# EAGLE design wifibasestation (EAGLE 6.5.0)
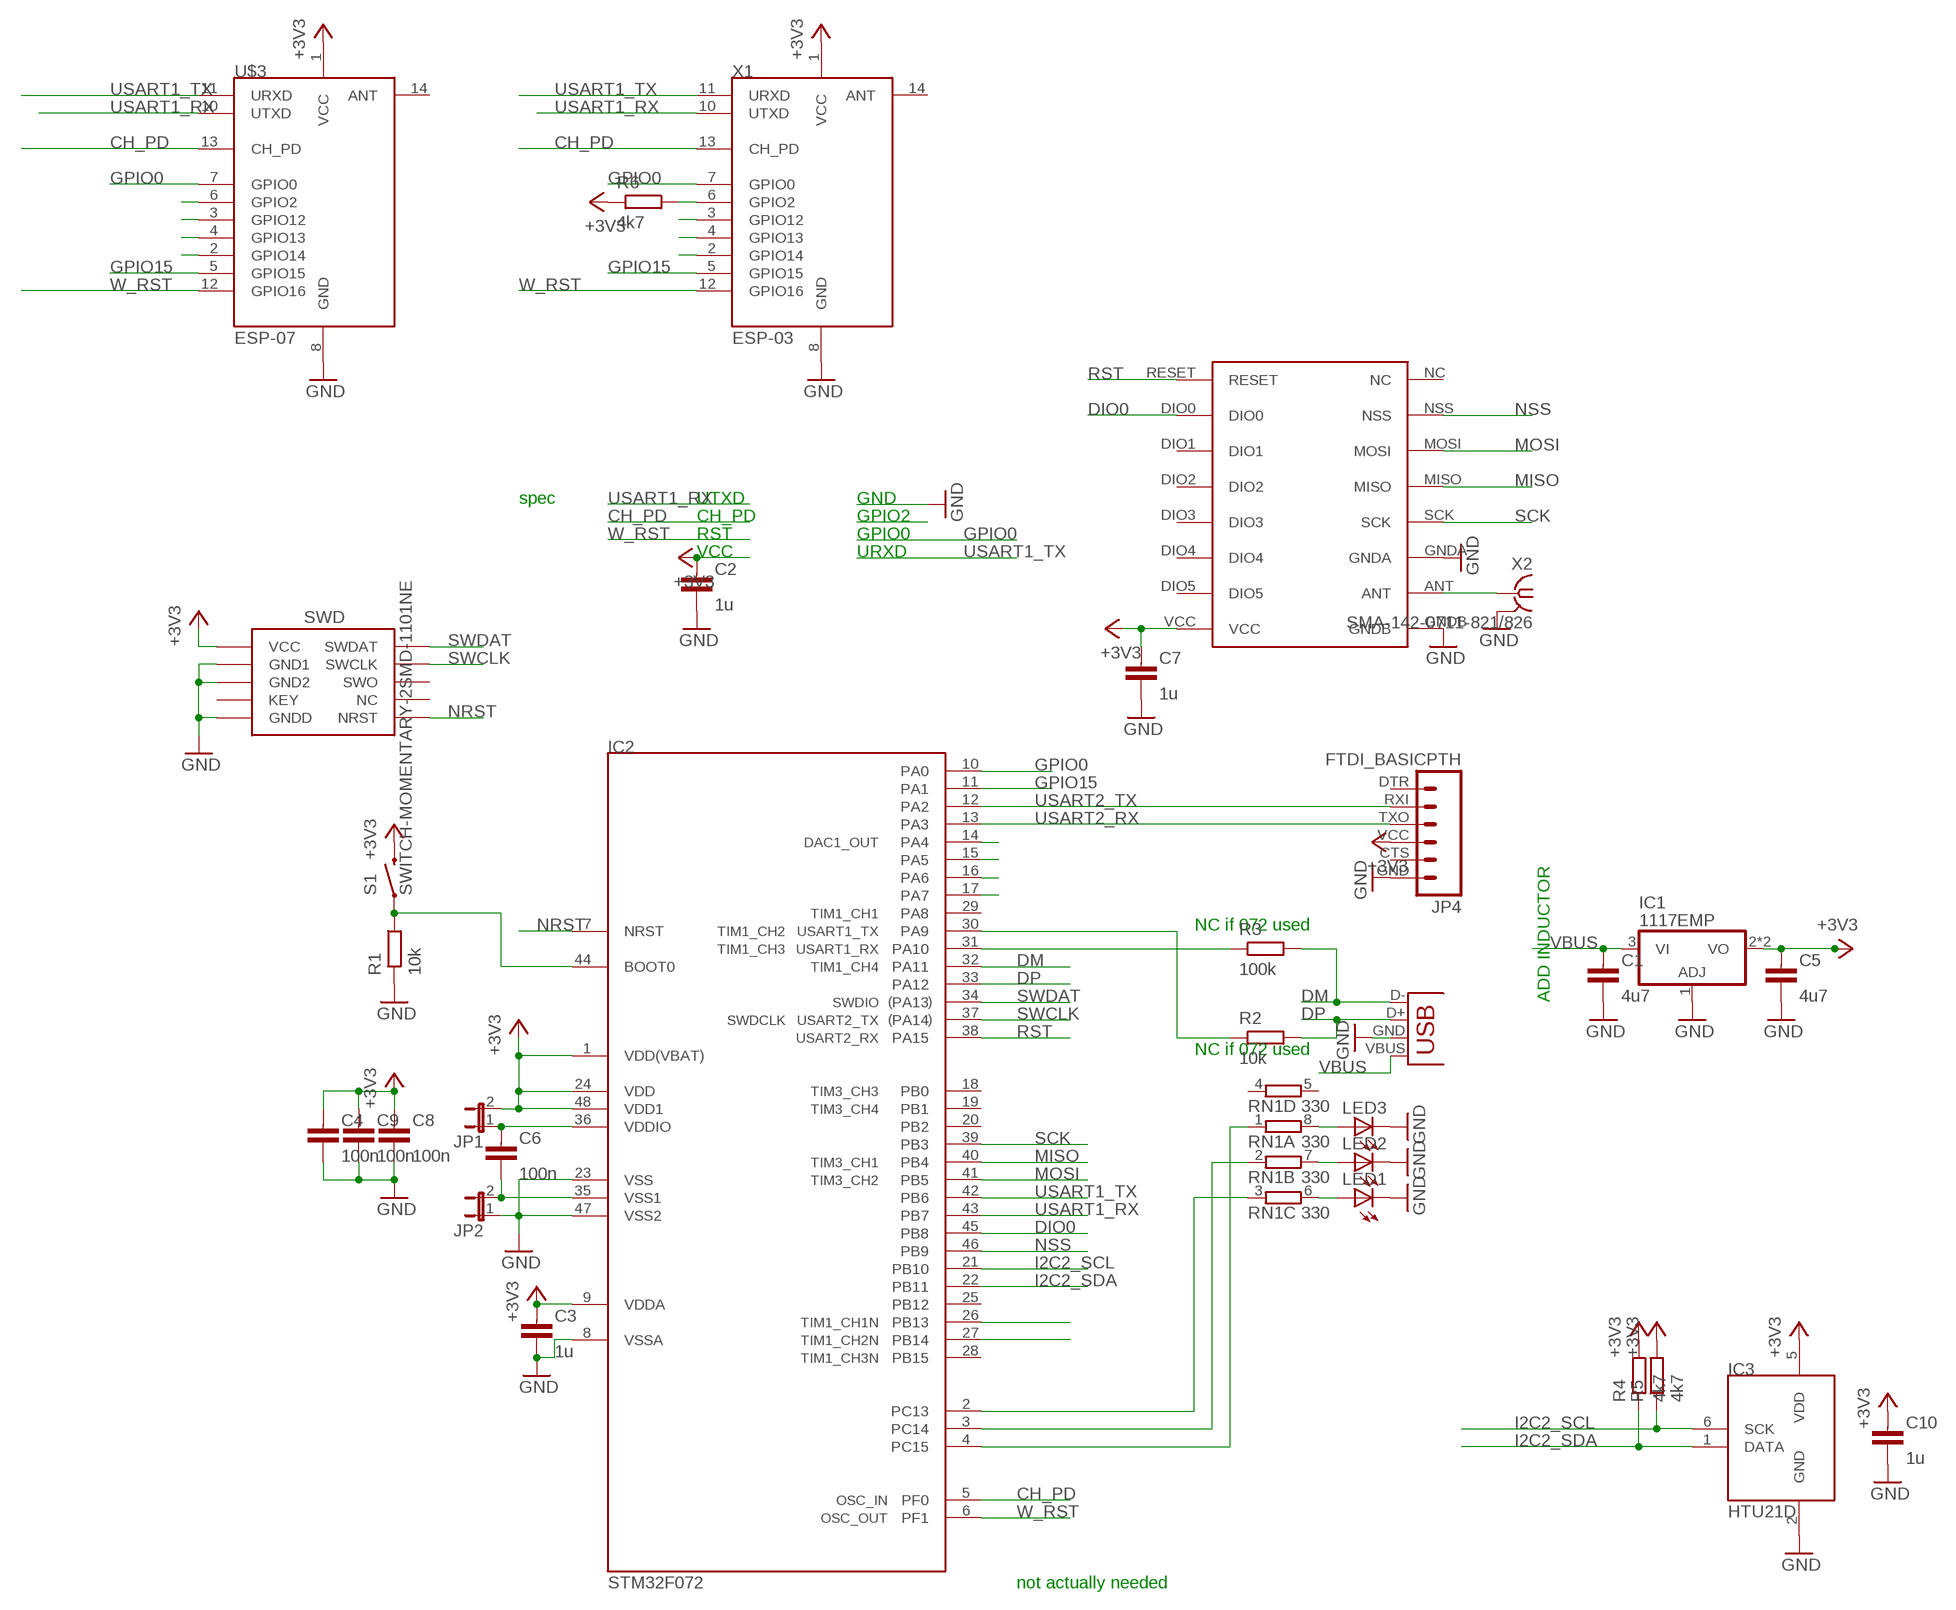
[diagram p0: schematic, sheet 1]

## Parts
C1  4u7  CAPACITOR0603-N  [C0603-N]
C2  1u  CAPACITOR0603-N  [C0603-N]
C3  1u  CAPACITOR0603-N  [C0603-N]
C4  100n  CAPACITOR0603-N  [C0603-N]
C5  4u7  CAPACITOR0805-N  [C0805-N]
C6  100n  CAPACITOR0603-N  [C0603-N]
C7  1u  CAPACITOR0603-N  [C0603-N]
C8  100n  CAPACITOR0603-N  [C0603-N]
C9  100n  CAPACITOR0603-N  [C0603-N]
C10  1u  CAPACITOR0603-N  [C0603-N]
IC1  1117EMP  [SOT223]
IC2  STM32F072  [TQFP48]
IC3  HTU21D  [DFN6-L]
J1  SWD_SHROUD_SMD  [SWD_SMD_SHROUD]
JP1  JUMPER-2SMD-NC  [SJ_2S]
JP2  JUMPER-2SMD-NC  [SJ_2S]
JP3  USB-A-H  [USB-A-H]
JP4  FTDI_BASICPTH  [FTDI_BASIC]
LED1  LEDCHIP-LED0805  [CHIP-LED0805]
LED2  LEDCHIP-LED0805  [CHIP-LED0805]
LED3  LEDCHIP-LED0805  [CHIP-LED0805]
R1  10k  RESISTOR0603-N  [R0603-N]
R2  10k  RESISTOR0603-N  [R0603-N]
R3  100k  RESISTOR0603-N  [R0603-N]
R4  4k7  RESISTOR0603-N  [R0603-N]
R5  4k7  RESISTOR0603-N  [R0603-N]
R6  4k7  RESISTOR0603-N  [R0603-N]
RN1  330  4R-NEXB38V  [EXB38V]
S1  SWITCH-MOMENTARY-2SMD-1101NE  [TACTILE-SWITCH-1101NE]
U$2  RFM69HW  [RFM]
U$3  ESP-07  [ESP-07]
X1  ESP-03  [ESP-03]
X2  SMA-142-0711-821/826  [J502-ND-142-0711-821/826]

## Nets
+3V3: C2.1 C3.1 C4.1 C5.1 C7.1 C8.1 C9.1 C10.1 IC1.2(VO) IC1.4(VO) IC2.1(VDD(VBAT)) IC2.9(VDDA) IC2.24(VDD) IC2.48(VDD1) IC3.5(VDD) J1.1(VCC) JP1.2 JP4.VCC R4.2 R5.2 R6.1 S1.2 U$2.VCC U$3.1(VCC) X1.1(VCC)
CH_PD: IC2.5(PF0) U$3.13(CH_PD) X1.13(CH_PD)
DIO0: IC2.45(PB8) U$2.DIO0
DM: IC2.32(PA11) JP3.D-(D+) R3.2
DP: IC2.33(PA12) JP3.D+(D-) R2.2
GND: C1.2 C2.2 C3.2 C4.2 C5.2 C7.2 C8.2 C9.2 C10.2 IC1.1(ADJ) IC2.8(VSSA) IC2.23(VSS) IC2.47(VSS2) IC3.2(GND) J1.3(GND1) J1.5(GND2) J1.9(GNDD) JP2.1 JP3.GND(VBUS) JP4.GND LED1.C LED2.C LED3.C R1.1 U$2.GNDA U$2.GNDB U$3.8(GND) X1.8(GND) X2.G@1 X2.G@2 X2.G@3 X2.G@4
GPIO0: IC2.10(PA0) U$3.7(GPIO0) X1.7(GPIO0)
GPIO15: IC2.11(PA1) U$3.5(GPIO15) X1.5(GPIO15)
I2C2_SCL: IC2.21(PB10) IC3.6(SCK) R5.1
I2C2_SDA: IC2.22(PB11) IC3.1(DATA) R4.1
MISO: IC2.40(PB4) U$2.MISO
MOSI: IC2.41(PB5) U$2.MOSI
N$1: R6.2 U$3.6(GPIO2) X1.6(GPIO2)
N$2: IC2.2(PC13) RN1.3
N$3: U$3.2(GPIO14) X1.2(GPIO14)
N$4: U$3.4(GPIO13) X1.4(GPIO13)
N$6: U$2.ANT X2.1
N$7: U$3.3(GPIO12) X1.3(GPIO12)
N$8: IC2.14(PA4)
N$9: LED3.A RN1.8
N$10: LED2.A RN1.7
N$11: C6.1 IC2.36(VDDIO) JP1.1
N$12: IC2.15(PA5)
N$13: C6.2 IC2.35(VSS1) JP2.2
N$14: IC2.16(PA6)
N$15: IC2.44(BOOT0) R1.2 S1.1
N$16: IC2.17(PA7)
N$17: IC2.31(PA10) R3.1
N$18: IC2.30(PA9) R2.1
N$20: LED1.A RN1.6
N$21: IC2.3(PC14) RN1.2
N$22: IC2.4(PC15) RN1.1
N$26: IC2.26(PB13)
N$27: IC2.27(PB14)
NRST: IC2.7(NRST) J1.10(NRST)
NSS: IC2.46(PB9) U$2.NSS
RST: IC2.38(PA15) U$2.RESET
SCK: IC2.39(PB3) U$2.SCK
SWCLK: IC2.37(PA14) J1.4(SWCLK)
SWDAT: IC2.34(PA13) J1.2(SWDAT)
USART1_RX: IC2.43(PB7) U$3.10(UTXD) X1.10(UTXD)
USART1_TX: IC2.42(PB6) U$3.11(URXD) X1.11(URXD)
USART2_RX: IC2.13(PA3) JP4.TXO
USART2_TX: IC2.12(PA2) JP4.RXI
VBUS: C1.1 IC1.3(VI) JP3.VBUS(GND)
W_RST: IC2.6(PF1) U$3.12(GPIO16) X1.12(GPIO16)
Unconnected: IC2.18(PB0) IC2.19(PB1) IC2.20(PB2) IC2.25(PB12) IC2.28(PB15) IC2.29(PA8) J1.6(SWO) J1.7(KEY) J1.8(NC) JP4.CTS JP4.DTR RN1.4 RN1.5 U$2.DIO1 U$2.DIO2 U$2.DIO3 U$2.DIO4 U$2.DIO5 U$2.NC U$3.14(ANT) X1.14(ANT)

## Notes on the sheet
- spec | UTXD | GND
- CH_PD | GPIO2
- RST | GPIO0
- VCC | URXD
- NC if 072 used
- ADD INDUCTOR
- NC if 072 used
- not actually needed

## Library data of the parts
C1-C10 = passives-7351:CAPACITOR
IC1 = dtb:*1117: Positive VOLTAGE REGULATOR
IC2 = dtb:STM32F072
IC3 = Mine:HTU21D
J1 = dtb:SWD_SHROUD
JP1 JP2 = SparkFun-Passives:JUMPER-2: Jumper Basic 0.1" spaced jumper. Use with breakaway headers.
JP3 = SparkFun-Connectors:USB: USB Connectors USB-B-PTH is fully proven SKU : PRT-00139/CONN-08278 USB-miniB is fully proven SKU : PRT-00587 USB-A-PCB is untested. USB-A-H is throughly reviewed, but untested. Spark Fun Electronics SKU : PRT-00437 USB-B-SMT is throughly reviewed, but untested. Needs silkscreen touching up. USB-A-S has not been used/tested USB-MB-H has not been used/tested USB-MICROB has been used. CONN-09505
JP4 = SparkFun-Connectors:FTDI_BASIC: FTDI Basic header with labels
LED1-LED3 = led:LED: LED OSRAM: - CHIPLED LG R971, LG N971, LY N971, LG Q971, LY Q971, LO R971, LY R971 LH N974, LH R974 LS Q976, LO Q976, LY Q976 LO Q996 - Hyper CHIPLED LW Q18S LB Q993, LB Q99A, LB R99A - SideLED LS A670, LO A670, LY A670, LG A670, LP A670 LB A673, LV A673, LT A673, LW A673 LH A674 LY A675 LS A676, LA A676, LO A676, LY A676, LW A676 LS A679, LY A679, LG A679 - Hyper Micro SIDELED® LS Y876, LA Y876, LO Y876, LY Y876 LT Y87S - SmartLED LW L88C, LW L88S LB L89C, LB L89S, LG L890 LS L89K, LO L89K, LY L89K LS L896, LA L896, LO L896, LY L896 - TOPLED LS T670, LO T670, LY T670, LG T670, LP T670 LSG T670, LSP T670, LSY T670, LOP T670, LYG T670 LG T671, LOG T671, LSG T671 LB T673, LV T673, LT T673, LW T673 LH T674 LS T676, LA T676, LO T676, LY T676, LB T676, LH T676, LSB T676, LW T676 LB T67C, LV T67C, LT T67C, LS T67K, LO T67K, LY T67K, LW E67C LS E67B, LA E67B, LO E67B, LY E67B, LB E67C, LV E67C, LT E67C LW T67C LS T679, LY T679, LG T679 LS T770, LO T770, LY T770, LG T770, LP T770 LB T773, LV T773, LT T773, LW T773 LH T774 LS E675, LA E675, LY E675, LS T675 LS T776, LA T776, LO T776, LY T776, LB T776 LHGB T686 LT T68C, LB T68C - Hyper Mini TOPLED® LB M676 - Mini TOPLED Santana® LG M470 LS M47K, LO M47K, LY M47K Source: http://www.osram.convergy.de LUXEON: - LUMILED® LXK2-PW12-R00, LXK2-PW12-S00, LXK2-PW14-U00, LXK2-PW14-V00 LXK2-PM12-R00, LXK2-PM12-S00, LXK2-PM14-U00 LXK2-PE12-Q00, LXK2-PE12-R00, LXK2-PE12-S00, LXK2-PE14-T00, LXK2-PE14-U00 LXK2-PB12-K00, LXK2-PB12-L00, LXK2-PB12-M00, LXK2-PB14-N00, LXK2-PB14-P00, LXK2-PB14-Q00 LXK2-PR12-L00, LXK2-PR12-M00, LXK2-PR14-Q00, LXK2-PR14-R00 LXK2-PD12-Q00, LXK2-PD12-R00, LXK2-PD12-S00 LXK2-PH12-R00, LXK2-PH12-S00 LXK2-PL12-P00, LXK2-PL12-Q00, LXK2-PL12-R00 Source: www.luxeon.com KINGBRIGHT: KA-3528ASYC Source: www.kingbright.com
R1-R6 = passives-7351:RESISTOR
RN1 = resistor-dil:4R-N: Array Chip Resistor Source: RS Component / Phycomp; OC_FARNELL: unknown; OC_NEWARK: unknown
S1 = SparkFun-Electromechanical:SWITCH-MOMENTARY-2: Various NO switches- pushbuttons, reed, etc; PROD_ID: SWCH-00815
U$2 = hoperf:RFM69HW
U$3 = Mine:ESP-07
X1 = Mine:ESP-03
X2 = con-coax:SMA-: SMA 50 Ohm End Launch Jack Receptacle - Round Contact Johnson Components Source: www.johnsoncomponents.com .. J502-ND.pdf; MF: JOHNSON COMPONENTS; MPN: 142-0711-821; OC_FARNELL: 1019328; OC_NEWARK: 16F3627

## Board
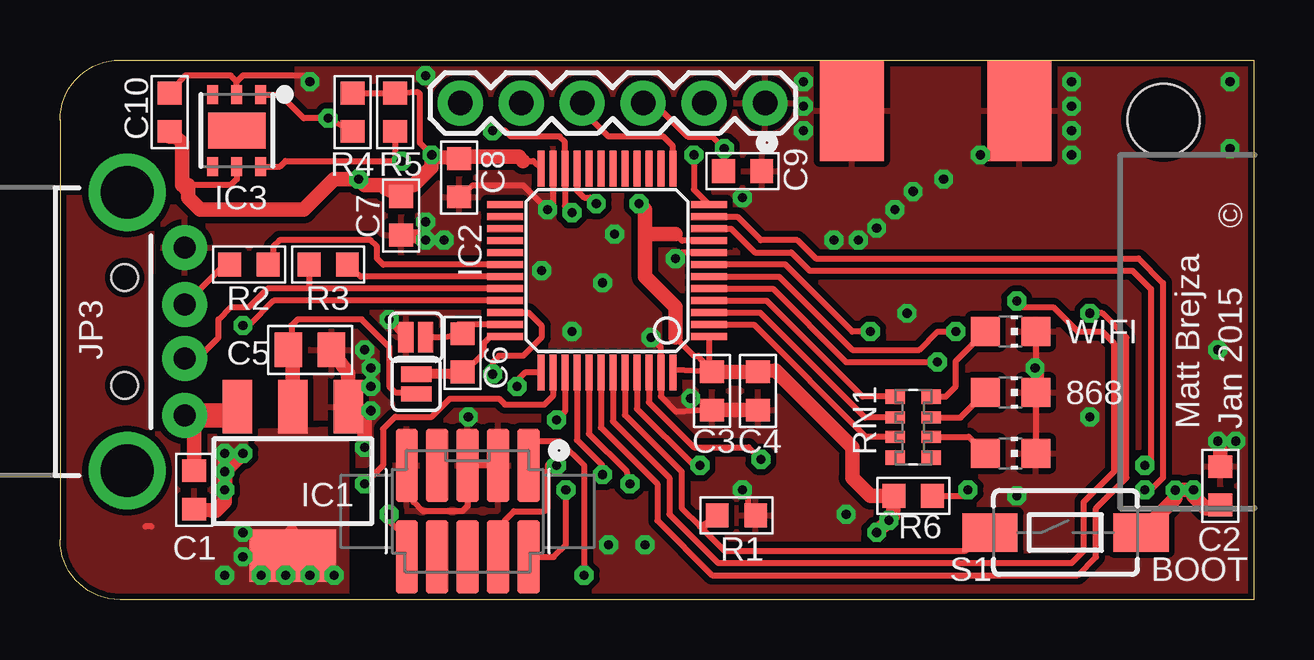
[diagram p1: board, top side]
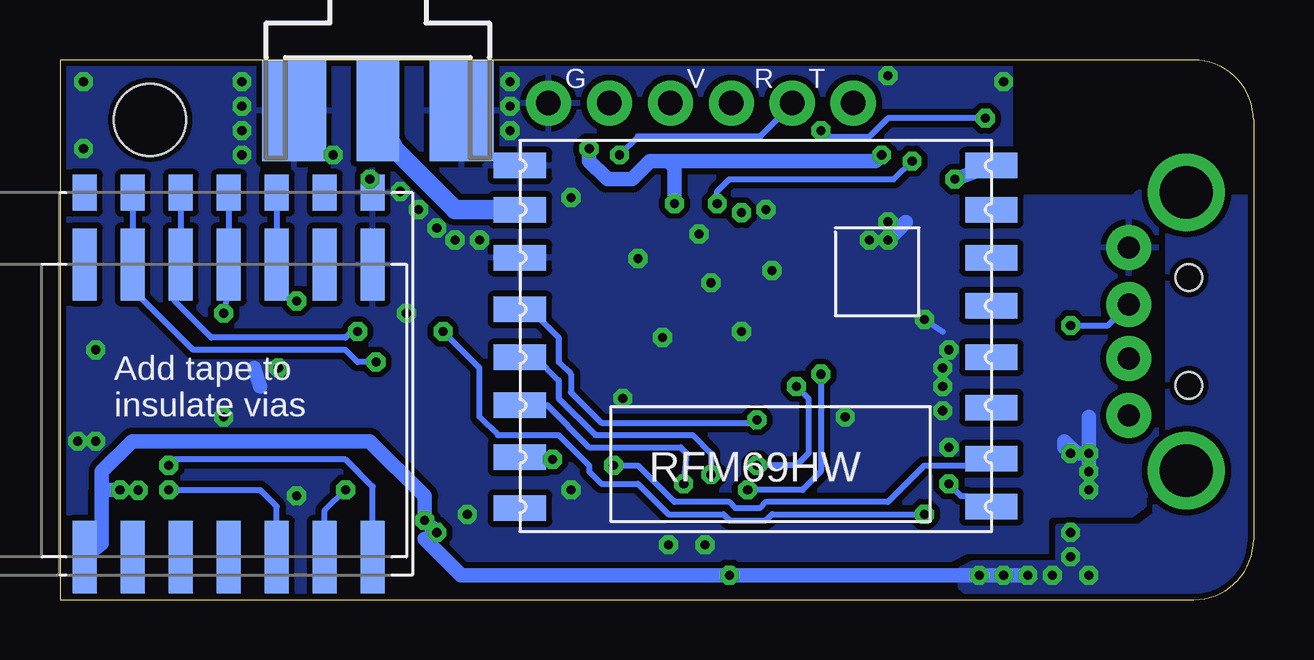
[diagram p2: board, bottom side, seen from below]

Size 49.75 x 22.5 mm. Coordinates in mm from the lower left corner, seen from the top.
Outline: 0,20.01 0,20
Outline: 0,20 0,2.5 arc90 2.5,0 49.75,0 49.75,22.5 2.5,22.5 arc90 0,20
Copper layers (1*16): Top 0.035mm / dielectric 1.5mm / Bottom 0.035mm
Design rules "default *": minimum track width 10mil, minimum drill 15mil, track to track 8mil, track to pad 8mil, pad to pad 7mil, via to via 8mil, smd to smd 0mil, copper to edge 10mil, drill to drill 8mil, minimum pad ring 10mil, minimum via ring 8mil, stop-mask expansion 4mil, vias tented up to drill 16mil, thermal gap 10mil
Holes 3 mm at 45.99,20.01

### Footprints (pad centres in the part's own frame; a part is rotated, then mirrored left to right if it is on the bottom)
C0603-N = smd 0.95 x 1: 1 -0.8,0; 2 0.8,0
C0805-N = smd 1.15 x 1.45: 1 -0.9,0; 2 0.9,0
SOT223 = smd 1.219 x 2.235: 1 -2.311,-3.099; 2 0,-3.099; 3 2.311,-3.099 | smd 3.6 x 2.2: 4 0,3.099
TQFP48 = smd 0.3 x 1.5: 1 -2.75,-4.25; 2 -2.25,-4.25; 3 -1.75,-4.25; 4 -1.25,-4.25; 5 -0.75,-4.25; 6 -0.25,-4.25; 7 0.25,-4.25; 8 0.75,-4.25; 9 1.25,-4.25; 10 1.75,-4.25; 11 2.25,-4.25; 12 2.75,-4.25; 25 2.75,4.25; 26 2.25,4.25; 27 1.75,4.25; 28 1.25,4.25; 29 0.75,4.25; 30 0.25,4.25; 31 -0.25,4.25; 32 -0.75,4.25; 33 -1.25,4.25; 34 -1.75,4.25; 35 -2.25,4.25; 36 -2.75,4.25 | smd 1.5 x 0.3: 13 4.25,-2.75; 14 4.25,-2.25; 15 4.25,-1.75; 16 4.25,-1.25; 17 4.25,-0.75; 18 4.25,-0.25; 19 4.25,0.25; 20 4.25,0.75; 21 4.25,1.25; 22 4.25,1.75; 23 4.25,2.25; 24 4.25,2.75; 37 -4.25,2.75; 38 -4.25,2.25; 39 -4.25,1.75; 40 -4.25,1.25; 41 -4.25,0.75; 42 -4.25,0.25; 43 -4.25,-0.25; 44 -4.25,-0.75; 45 -4.25,-1.25; 46 -4.25,-1.75; 47 -4.25,-2.25; 48 -4.25,-2.75
DFN6-L = smd 0.45 x 0.8: 1 -1,-1.5; 2 0,-1.5; 3 1,-1.5; 4 1,1.5; 5 0,1.5; 6 -1,1.5 | smd 2.4 x 1.5: EP 0,0
SWD_SMD_SHROUD = smd 0.914 x 3.048: 1 -2.54,-1.905; 2 -2.54,1.905; 3 -1.27,-1.905; 4 -1.27,1.905; 5 0,-1.905; 6 0,1.905; 7 1.27,-1.905; 8 1.27,1.905; 9 2.54,-1.905; 10 2.54,1.905
SJ_2S = smd 0.635 x 1.27: 1 -0.412,0; 2 0.412,0
USB-A-H = drill 0.914 pad 1.88: D+ 2.4,1.127; D- 2.4,-1.127; GND 2.4,3.5; VBUS 2.4,-3.5 | drill 2.2: GND2 0,-5.8; GND3 0,5.8 | hole 1.1: -0.1,2.25; -0.1,-2.25
FTDI_BASIC = drill 1.016 pad 1.88: CTS 10.16,0; DTR 0,0; GND 12.7,0; RXI 2.54,0; TXO 5.08,0; VCC 7.62,0
CHIP-LED0805 = smd 1.2 x 1.2: A 0,-1.05; C 0,1.05
R0603-N = smd 0.95 x 1: 1 -0.8,0; 2 0.8,0
EXB38V = smd 0.6 x 0.8: 1 -1.275,-0.75; 4 1.275,-0.75; 5 1.275,0.75; 8 -1.275,0.75 | smd 0.5 x 0.8: 2 -0.4,-0.75; 3 0.4,-0.75; 6 0.4,0.75; 7 -0.4,0.75
TACTILE-SWITCH-1101NE = smd 2.3 x 1.6: 1 -3.15,0; 2 3.15,0
RFM = smd 2.184 x 1.067: ANT 19.651,2.889; DIO0 0,13.27; DIO1 0,11.143; DIO2 0,9.047; DIO3 0,6.889; DIO4 0,4.889; DIO5 0,2.889; GNDA 19.651,4.889; GNDB 19.651,1.048; MISO 19.651,9.047; MOSI 19.651,11.047; NC 19.651,15.334; NSS 19.651,13.206; RESET 0,15.27; SCK 19.651,7.048; VCC 0,1.048
ESP-07 = smd 1 x 1.5: 1 -13.4,0; 2 -11.4,0; 3 -9.4,0; 4 -7.4,0; 5 -5.4,0; 6 -3.4,0; 7 -1.4,0; 8 -1.4,15.95; 9 -3.4,15.95; 10 -5.4,15.95; 11 -7.4,15.95; 12 -9.4,15.95; 13 -11.4,15.95; 14 -13.4,15.95
ESP-03 = smd 1 x 3: 1 -13.4,0; 2 -11.4,0; 3 -9.4,0; 4 -7.4,0; 5 -5.4,0; 6 -3.4,0; 7 -1.4,0; 8 -1.4,12.2; 9 -3.4,12.2; 10 -5.4,12.2; 11 -7.4,12.2; 12 -9.4,12.2; 13 -11.4,12.2; 14 -13.4,12.2
J502-ND-142-0711-821/826 = smd 4.191 x 1.778: 1 2.115,0 | smd 4.191 x 2.667: G@1 2.115,3.495; G@2 2.115,-3.495 | smd 4.191 x 2.667 bottom: G@3 2.115,3.495; G@4 2.115,-3.495

### Placement (x,y rotation side)
C1  5.59,4.58 270 top
C2  48.37,4.75 90 top
C3  27.18,8.7 270 top
C4  29.09,8.7 270 top
C5  10.42,10.42 0 top
C6  16.78,10.29 90 top
C7  14.23,16.01 270 top
C8  16.64,17.59 270 top
C9  28.45,17.86 0 top
C10  4.58,20.32 90 top
IC1  9.71,4.94 180 top
IC2  22.8,13.72 90 top
IC3  7.37,19.56 180 top
J1  16.99,3.69 180 top
JP1  14.85,8.99 270 top
JP2  14.83,10.94 0 top
JP3  2.8,11.18 0 top
JP4  16.69,20.7 0 top
LED1  39.63,6.1 270 top
LED2  39.63,8.64 270 top
LED3  39.63,11.18 270 top
R1  28.2,3.51 180 top
R2  7.88,13.97 180 top
R3  11.18,13.97 180 top
R4  12.2,20.32 90 top
R5  13.97,20.32 90 top
R6  35.56,4.32 0 top
RN1  35.56,7.2 270 top
S1  41.91,2.8 0 top
U$2  10.93,19.15 180 bottom
U$3  35.31,1.02 0 bottom
X1  35.31,1.78 0 bottom
X2  36.5,22.5 270 bottom

### Tracks (layer width: path | path; a pad name or v marks a point on that pad's centre or on a via)
+3V3  (via drill 0.38)
  Top 0.254: C3.1 25.66,9.58 IC2.48 | C3.1 26.6,10.16 26.42,10.16 25.66,10.93 | IC2.1 27.05,9.71 C3.1 | 3.81,3.05 3.56,3.05 | IC3.5 7.37,17.53 7.12,17.28 5.34,17.28 | C10.1 4.58,19.31 | R4.2 R5.2 14.9,21.17 14.99,21.09 14.99,19.05 v15.5,18.55 | C5.1 9.66,10.28 9.66,11.43 9.91,11.69 12.58,11.69 13.72,10.54 13.72,8.89 13.97,8.64 14.28,8.64 JP1.2 | JP4.VCC 24.77,20.7 26.17,19.31 27.18,19.31 v27.69,18.8 27.69,18.29 27.58,18.18 C9.1 | 19.31,18.29 19.73,18.29 IC2.24 | S1.2 45.06,3.15 | IC2.9 25.93,14.97 25.66,15.24 | 19.53,5.81 J1.1 19.56,5.62 19.56,6.35 19.82,6.61 20.83,6.61 21.85,5.59 v21.85,1.02
  Top 0.61: 9.66,2.8 9.91,2.54 | 13.72,17.28 14.74,17.28 15.5,18.04 v15.5,18.55 15.57,18.47 C8.1 16.67,18.47 19.13,18.47 19.31,18.29 | 13.72,17.28 12.7,17.28 v12.45,17.53 11.43,17.53 10.16,16.26 5.85,16.26 5.34,16.77 5.34,17.02 | C7.1 13.58,17.14 13.72,17.28 | IC1.2 9.71,10 C5.1 | 4.58,19.31 4.83,19.31 5.08,19.05 5.08,17.28 5.34,17.02 | 5.34,17.28 5.34,17.02 | 24.39,15.24 24.39,13.47 25.66,12.2 25.66,10.93 | 24.39,15.24 24.39,16.26 v24.13,16.51 | 25.66,15.24 24.39,15.24 | C3.1 C4.1 29.82,9.55 33.02,6.35 33.02,5.08 33.79,4.32 R6.1 34.71,3.47 v34.55,3.31 v34.04,2.8 | C2.1 48.29,3.81 47.76,3.81 47.25,4.32 v47.25,4.58 46.5,4.58 v46.49,4.56 46.49,4.22 S1.2
  Bottom 0.254: 27.18,18.04 26.93,17.53 | U$3.1 X1.1
  Bottom 0.61: v9.4,1.02 v21.85,1.02 33.02,1.02 34.55,2.54 v34.04,2.8 v34.55,3.31 34.55,4.32 36.83,6.61 46.74,6.61 48.01,5.34 48.01,4.58 | v27.69,18.8 27.69,18.29 26.93,17.53 25.91,17.53 25.15,18.29 24.39,18.29 | 24.39,18.29 15.75,18.29 v15.5,18.55 | U$2.VCC 10.86,18.1 v12.45,17.53 | X1.1 48.01,2.35 48.01,4.58 | 48.01,4.58 v47.25,4.58 | v24.13,16.51 24.13,18.04 24.39,18.29
  other vias: 7.62,2.8 7.62,1.78 8.39,1.02 10.42,1.02 11.43,1.02 6.86,1.02
  pour Top (isolate 0.254): -0.76,16.77 3.81,16.77 3.56,0.26 -0.5,0.77 -0.5,8.39 -0.76,8.39
  pour Bottom (isolate 0.254): 12.2,-2.54 4.07,3.56 4.07,6.1 3.56,7.12 3.56,15.75 4.32,16.51 3.81,17.02 2.29,17.28 2.29,17.53 1.78,16.77 -0.5,16.77 -0.5,-0.76 -0.25,-1.01
  pour Top (isolate 0.254, no thermals): 3.05,0 11.94,0 11.94,6.35 12.45,7.12 2.54,6.86 1.78,5.85 1.78,0.51 2.04,0.26
  pour Bottom (isolate 0.254): 3.56,0 11.69,0 12.2,0.51 12.2,1.27 11.69,1.53 8.13,1.53 8.13,3.05 4.07,3.05 3.81,3.31 3.81,1.53 3.56,1.27
CH_PD  (via drill 0.38)
  Top 0.254: v36.58,9.91 32.77,9.91 29.71,12.97 IC2.5
  Bottom 0.254: v36.58,9.91 37.34,9.91 37.85,10.42 44.2,10.42 46.74,12.96 46.74,13.95 X1.13 U$3.13
DIO0  (via drill 0.38)
  Top 0.254: IC2.45 24.05,7.96 26.42,5.59 v26.67,5.59
  Bottom 0.254: v26.67,5.59 25.66,5.59 24.13,4.07 21.85,4.07 21.59,3.81 20.58,3.81 20.32,4.07 15.24,4.07 13.72,5.59 11.21,5.59 U$2.DIO0
DM
  Top 0.254: IC2.32 10.42,12.97 | 10.42,12.97 8.65,12.97 7.88,12.2 7.12,12.2 6.61,11.69 6.61,10.93 5.74,10.05 JP3.D- | R3.2 10.38,13.01 10.42,12.97
DP  (via drill 0.38)
  Top 0.254: IC2.33 8.91,12.47 7.88,11.43 v7.62,11.43 | R2.2 6.88,13.99 JP3.D+
  Bottom 0.254: v7.62,11.43 6.07,11.43 JP3.D+
GND  (via drill 0.38)
  Top 0.254: C3.2 25.71,7.83 25.05,8.49 IC2.47 25.05,10.52 v24.64,10.93 | J1.3 J1.5 16.99,3.91 16.77,3.69 15.12,3.69 14.74,4.07 14.74,6.07 J1.9 14.23,6.32 14.23,6.86 | JP2.1 14.21,11.07 v13.72,11.69 | IC2.23 20.55,16.49 v20.32,16.26 19.31,17.28 17.2,17.28 C8.2 | IC3.2 7.37,21.59 | 7.37,21.59 7.12,21.85 5.22,21.85 C10.2 | v10.42,21.59 10.16,21.85 7.62,21.85 7.37,21.59 | R1.1 28.71,3.85 28.71,4.32 v28.45,4.58 | C9.2 29.33,17.64 | IC2.8 25.9,14.47 v25.66,14.23 | v12.96,7.88 12.18,7.88 IC1.1 | LED3.C LED2.C | LED2.C LED1.C | LED2.C 40.9,8.64 40.9,9.4 v40.64,9.66
  Top 0.305: J1.9 14.45,5.81
  Top 0.61: C7.2 14.88,15.13 v15.24,14.99 | IC1.1 12.02,9.44 C5.2 | C1.2 6.5,3.7 6.86,4.07 v6.86,5.34 | v6.86,5.34 v6.86,6.1 | v6.86,5.34 v7.62,6.1 | C2.2 48.37,6.25 v48.26,6.61 | C4.2 C3.2 | v12.7,6.35 12.7,7.62 v12.96,7.88
  Bottom 0.254: v13.72,11.69 12.96,11.18 | v28.45,16.77 28.2,16.77 | v24.64,10.93 24.39,10.93
  Bottom 0.61: 41.66,9.66 41.41,8.89 | v15.24,14.99 14.48,15.75 | v6.86,6.1 6.86,7.62 | v6.86,6.1 v6.86,5.34 | v6.86,6.1 7.37,6.1 7.88,6.61 7.88,6.35 v7.62,6.1
  other vias: 32.26,14.99 34.8,16.26 33.28,14.99 35.56,17.02 36.83,17.53 38.36,18.55 42.17,18.55 42.17,19.56 42.17,20.58 42.17,21.59 30.99,19.56 34.04,15.5 49.01,6.61 15.24,15.75 30.99,20.58 30.99,21.59 26.29,8.39 35.31,11.94 42.93,7.62 39.88,4.32 32.77,3.56 24.39,2.29 22.86,2.29 48.77,21.59 48.77,18.8 48.26,10.42 21.34,11.18 20.07,13.72 23.12,15.24 16.01,14.99 15.24,21.85 22.61,13.21 17.02,7.62 12.7,10.42 12.96,9.66 12.96,8.89 6.86,4.58
  pour Bottom (isolate 0.254, rank 2): -0.76,22.86 51.82,22.86 51.82,0 -1.77,0 -1.77,1.78
  pour Top (isolate 0.254, rank 2): 50.04,22.61 50.04,16.77 50.3,-1.27 13.47,-0.25 -1.77,-0.76 -2.03,16.51 9.91,16.26 9.91,23.37 11.69,23.63
GPIO0  (via drill 0.38)
  Top 0.254: IC2.10 27.97,15.47 28.96,14.48 30.48,14.48 31.25,13.72 44.71,13.72 45.47,12.96 45.47,5.85 v45.22,5.59
  Bottom 0.254: 44.96,5.59 v45.22,5.59 44.96,5.85 37.85,5.85 36.71,4.71 X1.7 U$3.7
GPIO15  (via drill 0.38)
  Top 0.254: IC2.11 28.23,15.97 29.21,14.99 30.74,14.99 31.5,14.23 44.96,14.23 45.98,13.21 45.98,5.08 45.47,4.58 v45.22,4.58
  Bottom 0.254: v45.22,4.58 41.41,4.58 40.71,3.88 X1.5 U$3.5
I2C2_SCL  (via drill 0.38)
  Top 0.254: IC2.21 21.55,17.07 21.85,16.77 22.1,16.77 v22.36,16.51 | IC3.6 9.17,18.06 9.4,18.29 v14.23,18.29 13.97,18.55 R5.1
  Bottom 0.254: v22.36,16.51 22.36,17.02 21.85,17.53 14.99,17.53 v14.23,18.29
I2C2_SDA  (via drill 0.38)
  Top 0.254: v21.34,16.13 21.05,16.42 IC2.22 21.05,19.09 20.83,19.31 18.8,19.31 18.55,19.56 v18.04,19.56 | R4.1 v11.18,20.07 10.16,20.07 9.17,21.06 IC3.1
  Bottom 0.254: v21.34,16.13 21.34,16.01 | v18.04,19.56 17.78,19.31 16.01,19.31 15.24,20.07 v11.18,20.07
MISO  (via drill 0.38)
  Top 0.254: IC2.40 21.55,6.65 22.61,5.59 v22.61,5.21
  Bottom 0.254: U$2.MISO 29.91,10.1 28.96,9.15 28.96,8.39 27.44,6.86 23.37,6.86 22.61,6.1 v22.61,5.21
MOSI  (via drill 0.38)
  Top 0.254: v23.75,4.83 23.63,5.34 22.05,6.91 IC2.41
  Bottom 0.254: U$2.MOSI 29.44,8.1 27.69,6.35 23.88,6.35 23.63,6.1 v23.75,4.83
N$1  (via drill 0.38)
  Top 0.254: R6.2 37.6,4.32 v37.85,4.58
  Bottom 0.254: v37.85,4.58 38.71,3.72 X1.6 U$3.6
N$2
  Top 0.254: IC2.2 28.92,11.47 33.6,6.79 RN1.3
N$3
  Bottom 0.254: X1.2 U$3.2
N$4
  Bottom 0.254: X1.4 U$3.4
N$6
  Bottom 0.813: U$2.ANT 33.28,16.26 35.82,18.8 36.33,19.73 X2.1
N$7
  Bottom 0.254: X1.3 U$3.3
N$9
  Top 0.254: RN1.8 36.92,8.47 37.34,8.89 37.34,9.94 LED3.A
N$10
  Top 0.254: RN1.7 37.53,7.59 LED2.A
N$11
  Top 0.254: IC2.36 17.95,10.97 17.66,10.67 17.66,10.29 16.77,9.4 16.29,9.4 C6.1 16.26,9.4
  Top 0.406: 16.26,9.4 JP1.1
N$13
  Top 0.254: IC2.35 16.58,11.47 C6.2 16.05,10.94 JP2.2
N$15
  Top 0.254: IC2.44 23.55,7.7 25.91,5.34 25.91,3.81 26.67,3.05 | 26.67,3.05 27.69,2.04 37.75,2.04 S1.1 | 26.67,3.05 26.89,3.05 27.18,3.35 | 26.67,3.05 27.18,3.35 | 27.18,3.35 R1.2
N$17
  Top 0.254: IC2.31 12.53,13.47 R3.1
N$18
  Top 0.254: IC2.30 13.47,13.97 13.21,14.23 13.21,14.74 12.96,14.99 9.15,14.99 8.89,14.74 8.89,14.14 R2.1
N$19
  cutout Bottom: 2.04,23.12 9.66,23.12 9.91,22.86 9.91,17.02 5.08,17.02 2.04,19.82
N$20
  Top 0.254: RN1.6 37.88,6.79 LED1.A
N$21
  Top 0.254: IC2.3 29.19,11.97 33.56,7.59 RN1.2
N$22
  Top 0.254: IC2.4 29.45,12.47 33.45,8.47 RN1.1
NRST  (via drill 0.38)
  Top 0.254: J1.10 14.2,2.8 13.72,3.27 v13.72,3.56 | v33.79,11.18 33.02,11.18 30.23,13.97 IC2.7
  Bottom 0.254: v13.72,3.56 20.07,3.56 20.32,3.31 21.85,3.31 22.1,3.56 24.39,3.56 25.66,4.83 27.18,4.83 27.69,5.34 27.69,5.59 28.96,6.86 31.5,6.86 32.26,7.62 32.26,9.66 v33.79,11.18
NSS  (via drill 0.38)
  Top 0.254: IC2.46 24.55,8.22 26.42,6.35 28.71,6.35 v29.21,5.85
  Bottom 0.254: U$2.NSS 29.31,5.94 v29.21,5.85
RST  (via drill 0.38)
  Top 0.254: IC2.38 20.55,8.48 20.2,8.13 18.55,8.13 18.29,8.39 16.26,8.39 15.5,7.62 13.97,7.62 13.47,7.12 13.47,5.59 v12.7,4.83
  Bottom 0.254: v12.7,4.83 12.2,4.32 11.94,4.32 11.43,3.81 10.99,3.81 U$2.RESET
SCK  (via drill 0.38)
  Top 0.254: IC2.39 21.05,7.84 v20.7,7.5
  Bottom 0.254: U$2.SCK 30.26,12.23 28.96,10.93 28.96,9.91 28.45,9.4 28.45,8.64 27.18,7.37 20.83,7.37 v20.7,7.5
SWCLK  (via drill 0.38)
  Top 0.254: IC2.37 19.38,9.47 19.05,9.15 v19.05,8.89 | J1.4 18.55,2.32 18.55,3.31 18.93,3.69 20.2,3.69 20.32,3.81 20.32,5.59 20.7,5.97 v20.7,5.59
  Bottom 0.254: v19.05,8.89 18.55,8.39 18.55,6.1 19.05,5.59 v20.7,5.59
SWDAT  (via drill 0.38)
  Top 0.254: IC2.34 19.53,11.97 20.07,11.43 20.07,10.93 19.31,10.16 18.29,10.16 18.04,9.91 v18.04,9.4 | J1.2 20.58,1.78 21.09,2.29 v21.09,4.58
  Bottom 0.254: v18.04,9.4 18.04,5.34 18.8,4.58 v21.09,4.58
USART1_RX  (via drill 0.38)
  Top 0.254: IC2.43 23.05,7.44 25.4,5.08 25.4,3.56 27.44,1.53 42.17,1.53 42.68,2.04 42.68,4.07 43.95,5.34 43.95,10.67 43.44,11.18 42.42,11.18 41.41,12.2 40.14,12.2 v39.88,12.45
  Bottom 0.254: U$3.10 X1.10 40.64,13.92 40.64,12.96 40.14,12.45 v39.88,12.45
USART1_TX  (via drill 0.38)
  Top 0.254: IC2.42 22.55,7.18 24.9,4.83 24.9,3.31 27.18,1.02 42.42,1.02 43.18,1.78 43.18,3.81 44.45,5.08 44.45,10.93 43.44,11.94 v42.93,11.94
  Bottom 0.254: U$3.11 X1.11 42.42,13.95 v42.93,11.94
USART2_RX
  Top 0.254: JP4.TXO 21.77,20.4 22.86,19.31 25.15,19.31 25.55,18.91 IC2.13
USART2_TX  (via drill 0.38)
  Top 0.254: v26.42,18.55 26.42,17.1 IC2.12
  Bottom 0.254: JP4.RXI 19.18,20.7 20.58,19.31 25.66,19.31 v26.42,18.55
VBUS
  Top 0.61: C1.1 5.59,7.29 JP3.VBUS
  Top 1.016: JP3.VBUS 7.04,7.68 IC1.3
W_RST  (via drill 0.38)
  Top 0.254: IC2.6 29.97,13.47 33.02,10.42 35.82,10.42 36.58,11.18 v37.34,11.18
  Bottom 0.254: v37.34,11.18 37.6,11.18 37.85,10.93 43.44,10.93 44.96,12.45 44.96,13.73 X1.12 U$3.12

### Text on the board
tPlace: IC3 | © | WIFI | 868 | Matt Brejza | Jan 2015 | BOOT
bPlace: T | R | V | G | Add tape to / insulate vias